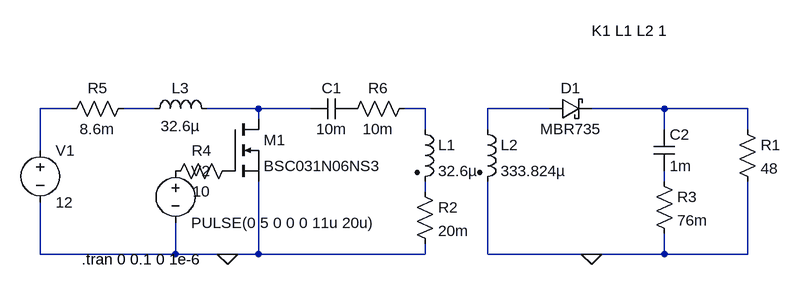
[diagram p0: schematic Simulation_wloses.asc]
Simulation_wloses.asc, the LTspice schematic file:
Version 4
SHEET 1 880 680
WIRE -400 128 -448 128
WIRE -272 128 -320 128
WIRE -112 128 -192 128
WIRE -32 128 -112 128
WIRE 144 128 112 128
WIRE 336 128 240 128
WIRE 512 128 400 128
WIRE 640 128 512 128
WIRE -112 144 -112 128
WIRE 144 160 144 128
WIRE 240 160 240 128
WIRE 512 160 512 128
WIRE 640 160 640 128
WIRE -448 192 -448 128
WIRE 512 240 512 224
WIRE 144 256 144 240
WIRE -448 352 -448 272
WIRE -240 352 -240 304
WIRE -240 352 -448 352
WIRE -160 352 -240 352
WIRE -112 352 -112 240
WIRE -112 352 -160 352
WIRE 144 352 144 336
WIRE 144 352 -112 352
WIRE 240 352 240 240
WIRE 400 352 240 352
WIRE 512 352 512 320
WIRE 512 352 400 352
WIRE 640 352 640 240
WIRE 640 352 512 352
FLAG -160 352 0
FLAG 400 352 0
SYMBOL ind2 128 144 R0
SYMATTR InstName L1
SYMATTR Value 32.6µ
SYMATTR Type ind
SYMBOL ind2 224 144 R0
SYMATTR InstName L2
SYMATTR Value 333.824µ
SYMATTR Type ind
SYMBOL cap -32 144 R270
WINDOW 0 32 32 VTop 2
WINDOW 3 0 32 VBottom 2
SYMATTR InstName C1
SYMATTR Value 10m
SYMBOL ind -288 144 R270
WINDOW 0 32 56 VTop 2
WINDOW 3 5 56 VBottom 2
SYMATTR InstName L3
SYMATTR Value 32.6µ
SYMBOL nmos -160 144 R0
SYMATTR InstName M1
SYMATTR Value BSC031N06NS3
SYMBOL schottky 336 144 R270
WINDOW 0 32 32 VTop 2
WINDOW 3 0 32 VBottom 2
SYMATTR InstName D1
SYMATTR Value MBR735
SYMATTR Description Diode
SYMATTR Type diode
SYMBOL cap 496 160 R0
SYMATTR InstName C2
SYMATTR Value 1m
SYMATTR SpiceLine IC=48
SYMBOL voltage -448 176 R0
WINDOW 123 0 0 Left 0
WINDOW 39 0 0 Left 0
SYMATTR InstName V1
SYMATTR Value 12
SYMBOL res 624 144 R0
SYMATTR InstName R1
SYMATTR Value 48
SYMBOL voltage -240 208 R0
WINDOW 123 0 0 Left 0
WINDOW 39 0 0 Left 0
SYMATTR InstName V2
SYMATTR Value PULSE(0 5 0 0 0 11u 20u)
SYMBOL res 128 240 R0
SYMATTR InstName R2
SYMATTR Value 20m
SYMBOL res 496 224 R0
SYMATTR InstName R3
SYMATTR Value 76m
SYMBOL res -144 208 R90
WINDOW 0 0 56 VBottom 2
WINDOW 3 32 56 VTop 2
SYMATTR InstName R4
SYMATTR Value 10
SYMBOL res -304 112 R90
WINDOW 0 0 56 VBottom 2
WINDOW 3 32 56 VTop 2
SYMATTR InstName R5
SYMATTR Value 8.6m
SYMBOL res 128 112 R90
WINDOW 0 0 56 VBottom 2
WINDOW 3 32 56 VTop 2
SYMATTR InstName R6
SYMATTR Value 10m
TEXT 400 8 Left 2 !K1 L1 L2 1
TEXT -384 360 Left 2 !.tran 0 0.1 0 1e-6

The netlist it stands for:
* Simulation_wloses.asc
L1 N004 N008 32.6µ
L2 N005 0 333.824µ
C1 N003 P001 10m
L3 N002 N003 32.6µ
M1 N003 P002 0 0 BSC031N06NS3
D1 N005 N006 MBR735
C2 N006 N007 1m IC=48
V1 N001 0 12
R1 N006 0 48
V2 P003 0 PULSE(0 5 0 0 0 11u 20u)
R2 N008 0 20m
R3 N007 0 76m
R4 P002 P003 10
R5 N002 N001 8.6m
R6 N004 P001 10m
.model D D
.lib standard.dio
.model NMOS NMOS
.model PMOS PMOS
.lib standard.mos
K1 L1 L2 1
.tran 0 0.1 0 1e-6
.backanno
.end